# Altium schematic sheet ASCII_15_BoardPowerSupply.SchDoc: Board power supply
size A3; Organization: Lime Microsystems; Address1: Surrey Tech Centre; Address2: Guildford GU2 7YG; Address3: Surrey; Address4: United Kingdom; Revision: v1.4; SheetNumber: 15; SheetTotal: 15
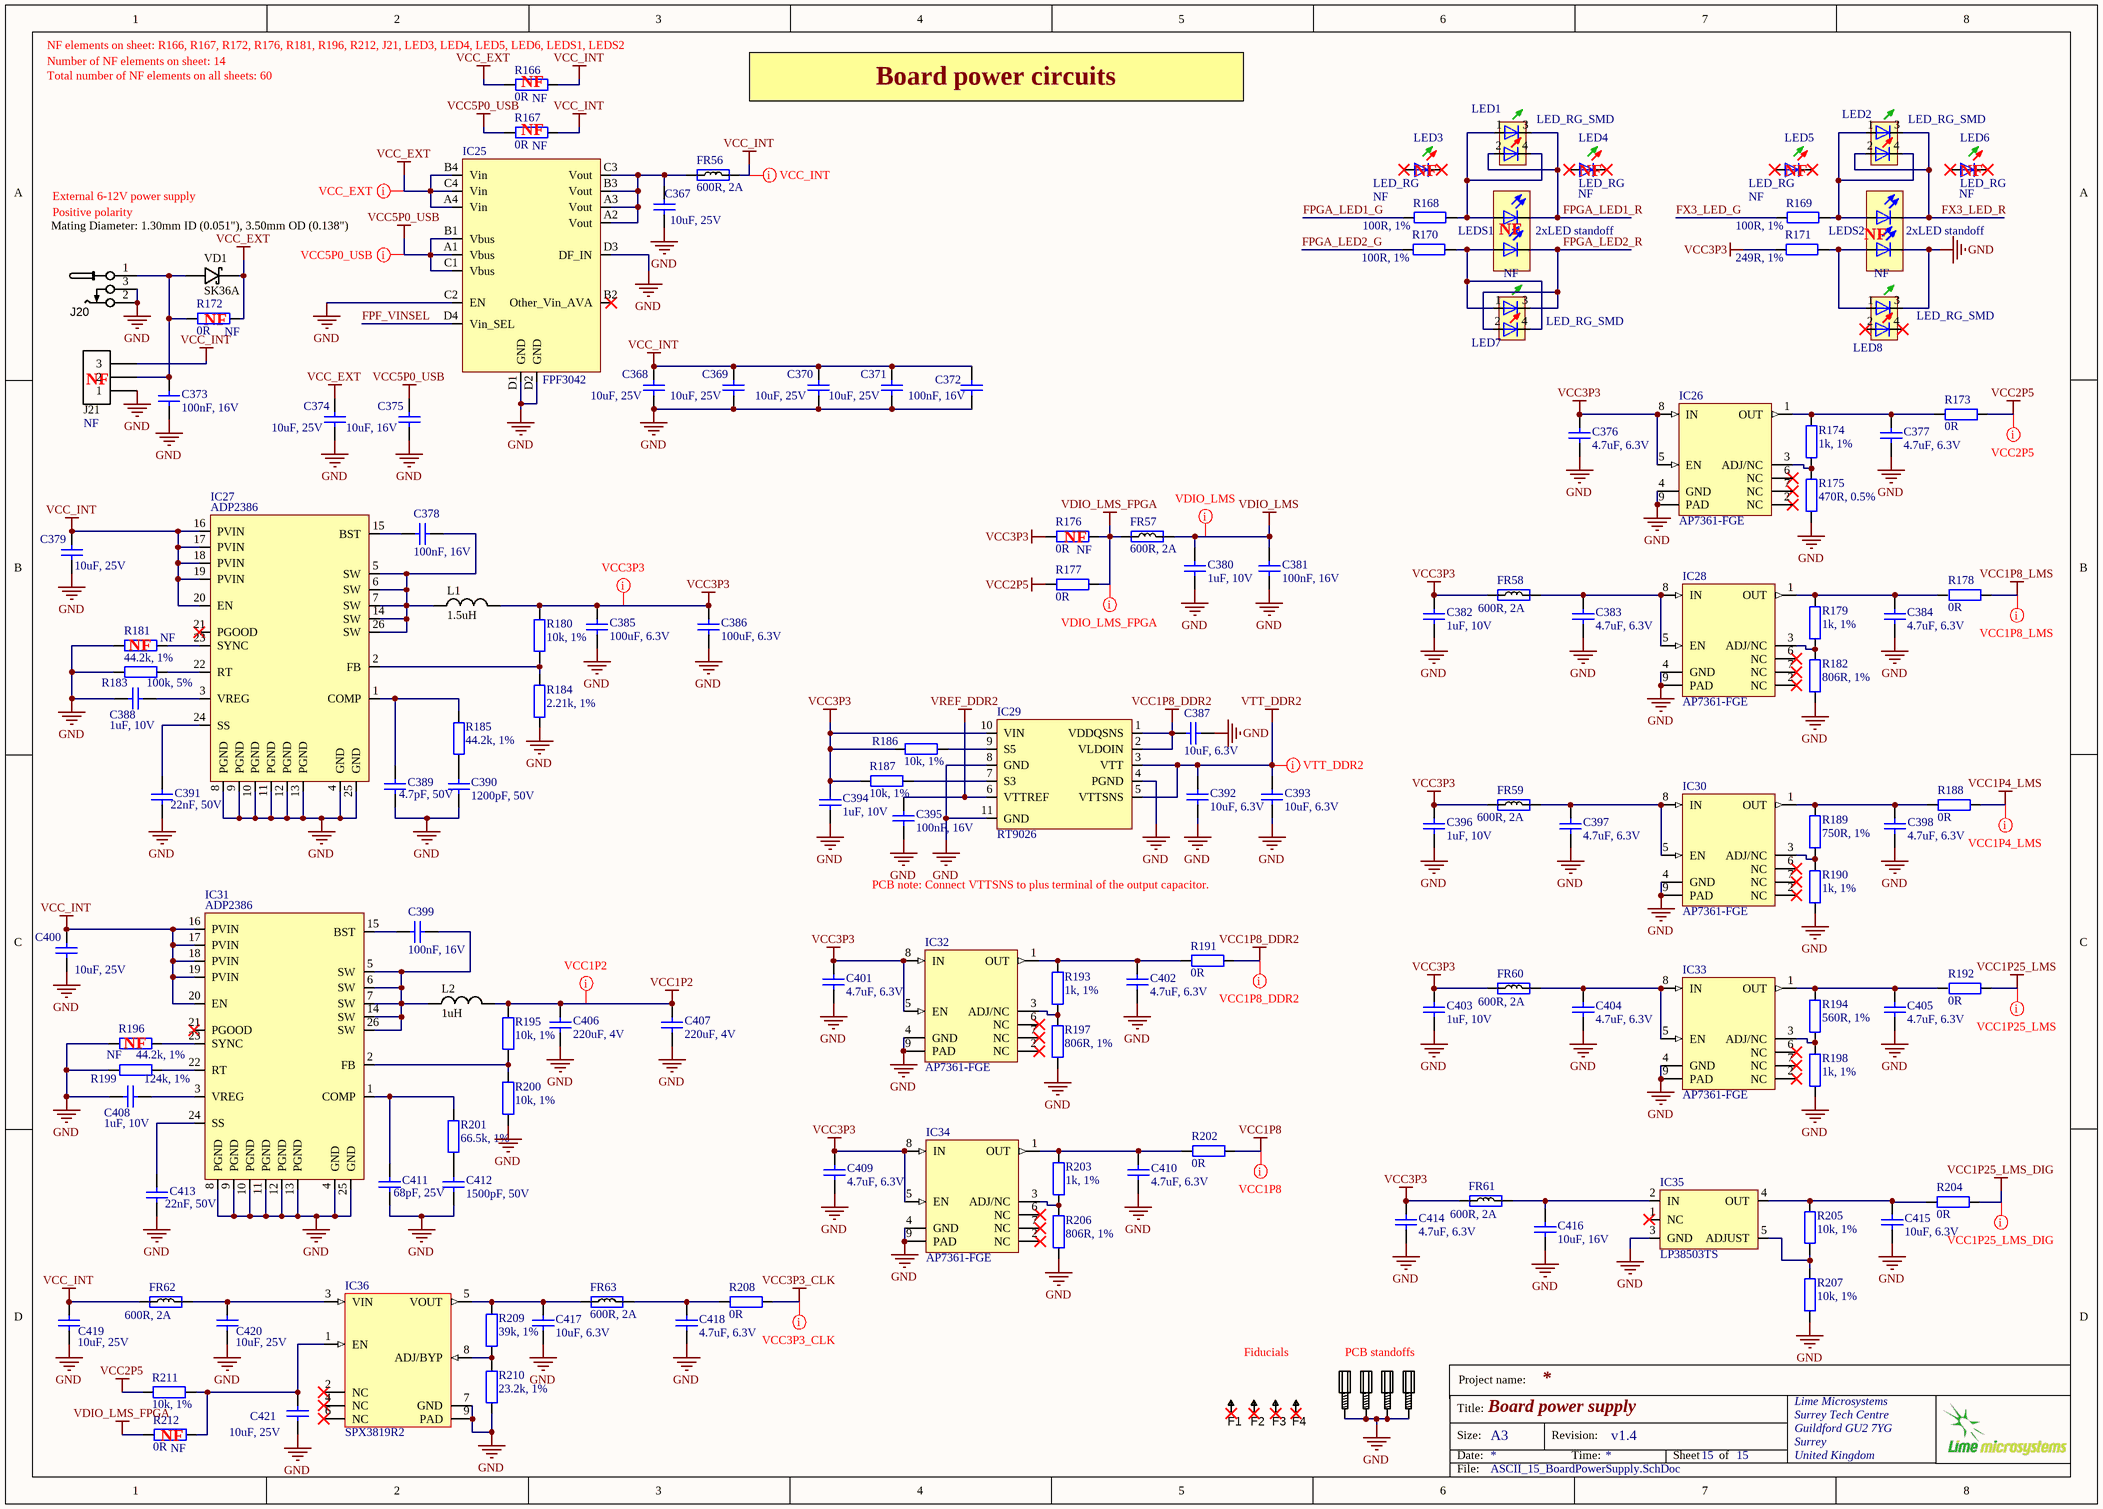
[diagram p0: ASCII_15_BoardPowerSupply.SchDoc]

## Parts
C367  10uF, 25V  [CAP0603]
C368  10uF, 25V  [CAP0603]
C369  10uF, 25V  [CAP0603]
C370  10uF, 25V  [CAP0603]
C371  10uF, 25V  [CAP0603]
C372  100nF, 16V  [CAP0402]
C373  100nF, 16V  [CAP0402]
C374  10uF, 25V  [CAP0603]
C375  10uF, 16V  [CAP0603]
C376  4.7uF, 6.3V  [CAP0402]
C377  4.7uF, 6.3V  [CAP0402]
C378  100nF, 16V  [CAP0402]
C379  10uF, 25V  [CAP0603]
C380  1uF, 10V  [CAP0402]
C381  100nF, 16V  [CAP0402]
C382  1uF, 10V  [CAP0402]
C383  4.7uF, 6.3V  [CAP0402]
C384  4.7uF, 6.3V  [CAP0402]
C385  100uF, 6.3V  [CAP1206]
C386  100uF, 6.3V  [CAP1206]
C387  10uF, 6.3V  [CAP0603]
C388  1uF, 10V  [CAP0402]
C389  4.7pF, 50V  [CAP0402]
C390  1200pF, 50V  [CAP0402]
C391  22nF, 50V  [CAP0402]
C392  10uF, 6.3V  [CAP0603]
C393  10uF, 6.3V  [CAP0603]
C394  1uF, 10V  [CAP0402]
C395  100nF, 16V  [CAP0402]
C396  1uF, 10V  [CAP0402]
C397  4.7uF, 6.3V  [CAP0402]
C398  4.7uF, 6.3V  [CAP0402]
C399  100nF, 16V  [CAP0402]
C400  10uF, 25V  [CAP0603]
C401  4.7uF, 6.3V  [CAP0402]
C402  4.7uF, 6.3V  [CAP0402]
C403  1uF, 10V  [CAP0402]
C404  4.7uF, 6.3V  [CAP0402]
C405  4.7uF, 6.3V  [CAP0402]
C406  220uF, 4V  [CAP1206]
C407  220uF, 4V  [CAP1206]
C408  1uF, 10V  [CAP0402]
C409  4.7uF, 6.3V  [CAP0402]
C410  4.7uF, 6.3V  [CAP0402]
C411  68pF, 25V  [CAP0402]
C412  1500pF, 50V  [CAP0402]
C413  22nF, 50V  [CAP0402]
C414  4.7uF, 6.3V  [CAP0402]
C415  10uF, 6.3V  [CAP0603]
C416  10uF, 16V  [CAP0603]
C417  10uF, 6.3V  [CAP0603]
C418  4.7uF, 6.3V  [CAP0402]
C419  10uF, 25V  [CAP0603]
C420  10uF, 25V  [CAP0603]
C421  10uF, 25V  [CAP0603]
F1  Fiducial  [Fiducial]  (value not drawn)
F2  Fiducial  [Fiducial]  (value not drawn)
F3  Fiducial  [Fiducial]  (value not drawn)
F4  Fiducial  [Fiducial]  (value not drawn)
FR56  600R, 2A  [RES0805]
FR57  600R, 2A  [RES0805]
FR58  600R, 2A  [RES0805]
FR59  600R, 2A  [RES0805]
FR60  600R, 2A  [RES0805]
FR61  600R, 2A  [RES0805]
FR62  600R, 2A  [RES0805]
FR63  600R, 2A  [RES0805]
IC25  FPF3042  [FPF3042]
IC26  AP7361-FGE  [AP7361]
IC27  ADP2386  [ADP2386]
IC28  AP7361-FGE  [AP7361]
IC29  RT9026  [MSOP10]
IC30  AP7361-FGE  [AP7361]
IC31  ADP2386  [ADP2386]
IC32  AP7361-FGE  [AP7361]
IC33  AP7361-FGE  [AP7361]
IC34  AP7361-FGE  [AP7361]
IC35  LP38503TS  [TO-263-5_v2]
IC36  SPX3819R2  [SPX3819R2-L/TR]
J20  Mating Diameter: 1.30mm ID (0.051"), 3.50mm OD (0.138")  [CONN_PWR_JACK_v4]
J21  Assembly Info: NF  [HDR_1x3]  (hidden comment: Header 3x1 pin)
L1  1.5uH  [FDVE1040_TOKO_INDUCTOR]
L2  1uH  [FDVE1040_TOKO_INDUCTOR]
LED1  LED_RG_SMD  [LED-2x0603]
LED2  LED_RG_SMD  [LED-2x0603]
LED3  LED_RG  Assembly Info: NF  (mechanical)
LED4  LED_RG  Assembly Info: NF  (mechanical)
LED5  LED_RG  Assembly Info: NF  (mechanical)
LED6  LED_RG  Assembly Info: NF  (mechanical)
LED7  LED_RG_SMD  [LED-2x0603]
LED8  LED_RG_SMD  [LED-2x0603]
LEDS1  2xLED standoff  Assembly Info: NF  [LED_STANDOFF_H-201C]
LEDS2  2xLED standoff  Assembly Info: NF  [LED_STANDOFF_H-201C]
MECH1  # pcs.  [PCB_standoff]  (value not drawn)
MECH2  # pcs.  [PCB_standoff]  (value not drawn)
MECH3  # pcs.  [PCB_standoff]  (value not drawn)
MECH4  # pcs.  [PCB_standoff]  (value not drawn)
R166  0R  Assembly Info: NF  [RES0402]
R167  0R  Assembly Info: NF  [RES0402]
R168  100R, 1%  [RES0402]
R169  100R, 1%  [RES0402]
R170  100R, 1%  [RES0402]
R171  249R, 1%  [RES0402]
R172  0R  Assembly Info: NF  [RES0805]
R173  0R  [RES0402]
R174  1k, 1%  [RES0402]
R175  470R, 0.5%  [RES0402]
R176  0R  Assembly Info: NF  [RES0402]
R177  0R  [RES0402]
R178  0R  [RES0402]
R179  1k, 1%  [RES0402]
R180  10k, 1%  [RES0402]
R181  44.2k, 1%  Assembly Info: NF  [RES0402]
R182  806R, 1%  [RES0402]
R183  100k, 5%  [RES0402]
R184  2.21k, 1%  [RES0402]
R185  44.2k, 1%  [RES0402]
R186  10k, 1%  [RES0402]
R187  10k, 1%  [RES0402]
R188  0R  [RES0402]
R189  750R, 1%  [RES0402]
R190  1k, 1%  [RES0402]
R191  0R  [RES0402]
R192  0R  [RES0402]
R193  1k, 1%  [RES0402]
R194  560R, 1%  [RES0402]
R195  10k, 1%  [RES0402]
R196  44.2k, 1%  Assembly Info: NF  [RES0402]
R197  806R, 1%  [RES0402]
R198  1k, 1%  [RES0402]
R199  124k, 1%  [RES0402]
R200  10k, 1%  [RES0402]
R201  66.5k, 1%  [RES0402]
R202  0R  [RES0402]
R203  1k, 1%  [RES0402]
R204  0R  [RES0402]
R205  10k, 1%  [RES0402]
R206  806R, 1%  [RES0402]
R207  10k, 1%  [RES0402]
R208  0R  [RES0402]
R209  39k, 1%  [RES0402]
R210  23.2k, 1%  [RES0402]
R211  10k, 1%  [RES0402]
R212  0R  Assembly Info: NF  [RES0402]
VD1  SK36A  [DIODE_SMB]

## Nets
GND: C367.1 C368.1 C369.1 C370.1 C371.1 C372.2 C373.2 C374.1 C375.1 C376.1 C377.1 C379.1 C380.1 C381.2 C382.1 C383.1 C384.1 C385.1 C386.1 C387.1 C388.2 C389.2 C390.2 C391.2 C392.1 C393.1 C394.1 C395.2 C396.1 C397.1 C398.1 C400.1 C401.1 C402.1 C403.1 C404.1 C405.1 C406.1 C407.1 C408.2 C409.1 C410.1 C411.2 C412.2 C413.2 C414.1 C415.1 C416.1 C417.1 C418.1 C419.1 C420.1 C421.1 IC25.C2(EN) IC25.D1(GND) IC25.D2(GND) IC25.D3(DF_IN) IC26.4(GND) IC26.9(PAD) IC27.4(GND) IC27.8(PGND) IC27.9(PGND) IC27.10(PGND) IC27.11(PGND) IC27.12(PGND) IC27.13(PGND) IC27.25(GND) IC28.4(GND) IC28.9(PAD) IC29.4(PGND) IC29.8(GND) IC29.11(GND) IC30.4(GND) IC30.9(PAD) IC31.4(GND) IC31.8(PGND) IC31.9(PGND) IC31.10(PGND) IC31.11(PGND) IC31.12(PGND) IC31.13(PGND) IC31.25(GND) IC32.4(GND) IC32.9(PAD) IC33.4(GND) IC33.9(PAD) IC34.4(GND) IC34.9(PAD) IC35.3(GND) IC36.7(GND) IC36.9(PAD) J20.2 J20.3 J21.1 LED8.3 LEDS2.K2(C) MECH1.MH1 MECH2.MH1 MECH3.MH1 MECH4.MH1 R175.2 R181.2 R182.2 R183.2 R184.1 R190.1 R196.2 R197.2 R198.1 R199.2 R200.2 R206.2 R207.2 R210.1
VCC1P2: C406.2 C407.2 L2.2 R195.1
VCC1P4_LMS: R188.1
VCC1P8: R202.1
VCC1P8_DDR2: C387.2 IC29.1(VDDQSNS) IC29.2(VLDOIN) R191.1
VCC1P8_LMS: R178.1
VCC1P25_LMS: R192.1
VCC1P25_LMS_DIG: R204.1
VCC2P5: R173.1 R177.2 R211.1
VCC3P3: C376.2 C382.2 C385.2 C386.2 C394.2 C396.2 C401.2 C403.2 C409.2 C414.2 FR58.1 FR59.1 FR60.1 FR61.1 IC26.5(EN) IC26.8(IN) IC29.10(VIN) IC32.5(EN) IC32.8(IN) IC34.5(EN) IC34.8(IN) L1.2 R171.1 R176.2 R180.1 R186.1 R187.1
VCC3P3_CLK: R208.1
VCC5P0_USB: C375.2 IC25.A1(Vbus) IC25.B1(Vbus) IC25.C1(Vbus) R167.2
VCC_EXT: C374.2 IC25.A4(Vin) IC25.B4(Vin) IC25.C4(Vin) R166.2 R172.1 VD1.K
VCC_INT: C368.2 C369.2 C370.2 C371.2 C372.1 C379.2 C400.2 C419.2 FR56.1 FR62.1 IC27.16(PVIN) IC27.17(PVIN) IC27.18(PVIN) IC27.19(PVIN) IC27.20(EN) IC31.16(PVIN) IC31.17(PVIN) IC31.18(PVIN) IC31.19(PVIN) IC31.20(EN) J21.3 R166.1 R167.1
VDIO_LMS: C380.2 C381.1 FR57.2
VDIO_LMS_FPGA: FR57.1 R176.1 R177.1 R212.2
VREF_DDR2: C395.1 IC29.6(VTTREF)
VTT_DDR2: C392.2 C393.2 IC29.3(VTT) IC29.5(VTTSNS)
FPF_VINSEL: IC25.D4(Vin_SEL)
FPGA_LED1_G: R168.1
FPGA_LED1_R: LED1.2 LED1.3 LEDS1.K1(C)
FPGA_LED2_G: R170.1
FPGA_LED2_R: LED7.2 LED7.3 LEDS1.K2(C)
FX3_LED_G: R169.1
FX3_LED_R: LED2.2 LED2.3 LEDS2.K1(C)
NetC367_2: C367.2 FR56.2 IC25.A2(Vout) IC25.A3(Vout) IC25.B3(Vout) IC25.C3(Vout)
NetC373_1: C373.1 J20.1 J21.2 R172.2 VD1.A
NetC377_2: C377.2 IC26.1(OUT) R173.2 R174.2
NetC378_1: C378.1 IC27.15(BST)
NetC378_2: C378.2 IC27.5(SW) IC27.6(SW) IC27.7(SW) IC27.14(SW) IC27.26(SW) L1.1
NetC383_2: C383.2 FR58.2 IC28.5(EN) IC28.8(IN)
NetC384_2: C384.2 IC28.1(OUT) R178.2 R179.2
NetC388_1: C388.1 IC27.3(VREG)
NetC389_1: C389.1 IC27.1(COMP) R185.2
NetC390_1: C390.1 R185.1
NetC391_1: C391.1 IC27.24(SS)
NetC397_2: C397.2 FR59.2 IC30.5(EN) IC30.8(IN)
NetC398_2: C398.2 IC30.1(OUT) R188.2 R189.1
NetC399_1: C399.1 IC31.15(BST)
NetC399_2: C399.2 IC31.5(SW) IC31.6(SW) IC31.7(SW) IC31.14(SW) IC31.26(SW) L2.1
NetC402_2: C402.2 IC32.1(OUT) R191.2 R193.2
NetC404_2: C404.2 FR60.2 IC33.5(EN) IC33.8(IN)
NetC405_2: C405.2 IC33.1(OUT) R192.2 R194.2
NetC408_1: C408.1 IC31.3(VREG)
NetC410_2: C410.2 IC34.1(OUT) R202.2 R203.2
NetC411_1: C411.1 IC31.1(COMP) R201.2
NetC412_1: C412.1 R201.1
NetC413_1: C413.1 IC31.24(SS)
NetC415_2: C415.2 IC35.4(OUT) R204.2 R205.1
NetC416_2: C416.2 FR61.2 IC35.2(IN)
NetC417_2: C417.2 FR63.1 IC36.5(VOUT) R209.1
NetC418_2: C418.2 FR63.2 R208.2
NetC420_2: C420.2 FR62.2 IC36.3(VIN)
NetC421_2: C421.2 IC36.1(EN) R211.2 R212.1
NetIC26_3: IC26.3(ADJ/NC) R174.1 R175.1
NetIC27_2: IC27.2(FB) R180.2 R184.2
NetIC27_22: IC27.22(RT) R183.1
NetIC27_23: IC27.23(SYNC) R181.1
NetIC28_3: IC28.3(ADJ/NC) R179.1 R182.1
NetIC29_7: IC29.7(S3) R187.2
NetIC29_9: IC29.9(S5) R186.2
NetIC30_3: IC30.3(ADJ/NC) R189.2 R190.2
NetIC31_2: IC31.2(FB) R195.2 R200.1
NetIC31_22: IC31.22(RT) R199.1
NetIC31_23: IC31.23(SYNC) R196.1
NetIC32_3: IC32.3(ADJ/NC) R193.1 R197.1
NetIC33_3: IC33.3(ADJ/NC) R194.1 R198.2
NetIC34_3: IC34.3(ADJ/NC) R203.1 R206.1
NetIC35_5: IC35.5(ADJUST) R205.2 R207.1
NetIC36_8: IC36.8(ADJ/BYP) R209.2 R210.2
NetLED1_1: LED1.1 LED1.4 LEDS1.A1(A) R168.2
NetLED2_1: LED2.1 LED2.4 LEDS2.A1(A) R169.2
NetLED7_1: LED7.1 LED7.4 LEDS1.A2(A) R170.2
NetLED8_1: LED8.1 LEDS2.A2(A) R171.2

Not connected (* = marked no-connect by the designer): F1 1*; F2 1*; F3 1*; F4 1*; IC25 B2(Other_Vin_AVA)*; IC26 2(NC)* 6(NC)* 7(NC)*; IC27 21(PGOOD)*; IC28 2(NC)* 6(NC)* 7(NC)*; IC30 2(NC)* 6(NC)* 7(NC)*; IC31 21(PGOOD)*; IC32 2(NC)* 6(NC)* 7(NC)*; IC33 2(NC)* 6(NC)* 7(NC)*; IC34 2(NC)* 6(NC)* 7(NC)*; IC35 1(NC)*; IC36 2(NC)* 4(NC)* 6(NC)*; LED3 A* K(C)*; LED4 A* K(C)*; LED5 A* K(C)*; LED6 A* K(C)*; LED8 2* 4*

## Layout directives
net class VDIO_LMS: VDIO_LMS
net class VDIO_LMS_FPGA: VDIO_LMS_FPGA
net class VCC2P5: VCC2P5
net class VCC1P8_LMS: VCC1P8_LMS
net class VCC1P4_LMS: VCC1P4_LMS
net class VCC1P25_LMS: VCC1P25_LMS
net class VCC1P25_LMS_DIG: VCC1P25_LMS_DIG
net class VCC1P8_DDR2: VCC1P8_DDR2
net class VCC1P8: VCC1P8
net class VCC3P3_CLK: VCC3P3_CLK
net class VCC1P2: VCC1P2
net class VCC3P3: VCC3P3
net class VCC_INT: VCC_INT
net class VCC_EXT: VCC_EXT
net class VCC5P0_USB: VCC5P0_USB
net class VTT_DDR2: VTT_DDR2

## Notes on the sheet
- Number of NF elements on sheet: 14
- Total number of NF elements on all sheets: 60
- (near R166) NF elements on sheet: R166, R167, R172, R176, R181, R196, R212, J21, LED3, LED4, LED5, LED6, LEDS1, LEDS2
- (near R166) NF
- Board power circuits
- (near R167) NF
- (near LED3) NF
- (near LED4) NF
- (near LED5) NF
- (near LED6) NF
- Positive polarity
- External 6-12V power supply
- (near LEDS1) NF
- (near LEDS2) NF
- (near J21) NF
- (near R172) NF
- (near R176) NF
- (near R181) NF
- PCB note: Connect VTTSNS to plus terminal of the output capacitor.
- (near R196) NF
- Fiducials
- PCB standoffs
- (near R212) NF
- Project name:
- Title:
- Size:
- Date:
- A3
- Revision:
- Time:
- Sheet
- of
- File:

## Library data of the parts
C367-C371 C374 C379 C400 C419-C421 = Cap_0603: Manufacturer: Murata Electronics North America; Manufacturer Part Number: GRM188R61E106MA73D; Part Description: 10µF ±20% 25V X5R Ceramic Capacitor -55°C ~ 85°C Surface Mount, MLCC 0603 (1608 Metric) 0.063" L x 0.031" W (1.60mm x 0.80mm); Capacitance: 10µF; Tolerance: ±20%; Temperature Coefficient: X5R; Supplier 1: Digi-Key; Supplier Part Number 1: 490-7202-2-ND; Category: Capacitors; RoHS: RoHS Compliant; Packaging: Tape & Reel (TR); Voltage - Rated: 25V; Mounting Type: Surface Mount, MLCC; Operating Temperature: -55°C ~ 85°C; Applications: General Purpose; Ratings: -; Package / Case: 0603 (1608 Metric); Size / Dimension: 0.063" L x 0.031" W (1.60mm x 0.80mm); Height - Seated (Max): -; Thickness (Max): 0.031" (0.80mm); Lead Spacing: -; Features: -; Lead Style: -; value: 10uF, 25V
C372 C373 C381 C395 = Cap_0402: Manufacturer: Murata Electronics; Manufacturer Part Number: GRM155R71C104KA88D; Part Description: 0.10µF ±10% 16V X7R Ceramic Capacitor -55°C ~ 125°C Surface Mount, MLCC 0402 (1005 Metric) 0.039" L x 0.020" W (1.00mm x 0.50mm); Tolerance: 10 %; Type: General Purpose MLCC; Capacitance: 0.1 uF; Case Length: 1 mm; Dielectric: X7R; Case Height: 0.5 mm; Temperature Coefficient / Code: +/- 15 %; Value: 100nF, 16V; Supplier 1: Mouser; Supplier Part Number 1: 81-GRM155R71C104KA88; Case Code - in: 0402; RoHS: RoHS Compliant; Operating Temperature Range: - 55 C to + 125 C; Series: GRM; Termination Style: SMD/SMT; Package / Case: 0402 (1005 metric); Voltage Rating DC: 16 V; Maximum Operating Temperature: + 125 C; Case Code - mm: 1005; Minimum Operating Temperature: - 55 C; Product Category: Low & Medium Capacitance SMD Ceramic Chip Capacitors; Packaging: Reel; Product: General Type MLCCs; Category: Multilayer Ceramic Capacitors MLCC - SMD/SMT; Brand: Murata Electronics; Case Width: 0.5 mm; RoHS - Mouser: Y; Standard Pack Qty: 10000; Minimum Order Quantity: 1; Reeling: True; Manufacturer Part Number 1: GRM155R71C104KA88D
C375 C416 = Cap_0603: Manufacturer: Yageo; Manufacturer Part Number 1: GRM188R61C106MA73D; Part Description: 10µF ±20% 16V X5R Ceramic Capacitor -55°C ~ 85°C Surface Mount, MLCC 0603 (1608 Metric) 0.063" L x 0.031" W (1.60mm x 0.80mm); Temperature Coefficient: X5R; Capacitance: 10µF; Tolerance: ±20%; Value: 10uF, 16V; Supplier 1: Digi-Key; Supplier Part Number 1: 490-7201-2-ND; Category: Capacitors; Ratings: -; Features: -; Lead Style: -; Package / Case: 0603 (1608 Metric); Lead Spacing: -; Applications: General Purpose; Voltage - Rated: 16V; Operating Temperature: -55°C ~ 85°C; Thickness (Max): 0.039" (1.00mm); Mounting Type: Surface Mount, MLCC; RoHS: RoHS Compliant; Size / Dimension: 0.063" L x 0.031" W (1.60mm x 0.80mm); Packaging: Tape & Reel (TR); Height - Seated (Max): -
C376 C377 C383 C384 C397 C398 C401 C402 C404 C405 C409 C410 C414 C418 = Cap_0402: Manufacturer: Murata Electronics North America; Manufacturer Part Number: GRM155R60J475ME87D; Part Description: 4.7µF ±20% 6.3V X5R Ceramic Capacitor -55°C ~ 85°C Surface Mount, MLCC 0402 (1005 Metric) 0.039" L x 0.020" W (1.00mm x 0.50mm); Tolerance: ±20%; Capacitance: 4.7µF; Temperature Coefficient: X5R; Lead Style: -; Ratings: -; Height - Seated (Max): -; Thickness (Max): 0.022" (0.55mm); Voltage - Rated: 6.3V; Packaging: Cut Tape (CT); Lead Spacing: -; Category: Capacitors; Supplier Part Number 1: 490-5408-1-ND; Applications: General Purpose; Operating Temperature: -55°C ~ 85°C; Mounting Type: Surface Mount, MLCC; Features: Derating Recommended; RoHS: RoHS Compliant; Supplier 1: Digi-Key; Package / Case: 0402 (1005 Metric); Size / Dimension: 0.039" L x 0.020" W (1.00mm x 0.50mm); Value: 4.7uF, 6.3V
C378 C399 = Cap_0402: Manufacturer: Murata Electronics; Manufacturer Part Number 1: GRM155R71C104KA88D; Part Description: 0.10µF ±10% 16V X7R Ceramic Capacitor -55°C ~ 125°C Surface Mount, MLCC 0402 (1005 Metric) 0.039" L x 0.020" W (1.00mm x 0.50mm); Tolerance: 10 %; Type: General Purpose MLCC; Capacitance: 0.1 uF; Case Length: 1 mm; Dielectric: X7R; Case Height: 0.5 mm; Temperature Coefficient / Code: +/- 15 %; Value: 100nF, 16V; Supplier 1: Mouser; Supplier Part Number 1: 81-GRM155R71C104KA88; Case Code - in: 0402; RoHS: RoHS Compliant; Operating Temperature Range: - 55 C to + 125 C; Series: GRM; Termination Style: SMD/SMT; Package / Case: 0402 (1005 metric); Voltage Rating DC: 16 V; Maximum Operating Temperature: + 125 C; Case Code - mm: 1005; Minimum Operating Temperature: - 55 C; Product Category: Low & Medium Capacitance SMD Ceramic Chip Capacitors; Packaging: Reel; Product: General Type MLCCs; Category: Multilayer Ceramic Capacitors MLCC - SMD/SMT; Brand: Murata Electronics; Case Width: 0.5 mm; RoHS - Mouser: Y; Standard Pack Qty: 10000; Minimum Order Quantity: 1; Reeling: True; Manufacturer Part Number: GRM155R71C104KA88D
C380 C382 C388 C394 C396 C403 C408 = Cap_0402: Manufacturer Part Number 1: GRM155R61A105KE15J; Manufacturer: TDK; Part Description: 1µF ±10% 10V X5R Ceramic Capacitor -55°C ~ 85°C Surface Mount, MLCC 0402 (1005 Metric) 0.039" L x 0.020" W (1.00mm x 0.50mm); Voltage Rating: 10; Capacitance Tolerance: ± 10%; Product Range: TDK - C Series; Ceramic Capacitor Case: 0402 [1005 Metric]; Capacitance: 1; Dielectric Characteristic: X6; Value: 1uF, 10V; Supplier 1: Newark; Supplier Part Number 1: 490-6298-2-ND; MSL: -; RoHS: YES
C385 C386 = Cap_1206: Manufacturer Part Number 1: GRM31CR60J107ME39L.; Part Description: 100µF ±20% 6.3V X5R Ceramic Capacitor -55°C ~ 85°C Surface Mount, MLCC 1206 (3216 Metric) 0.126" L x 0.063" W (3.20mm x 1.60mm); Manufacturer: Murata Electronics North America; Capacitance Tolerance: ± 20%; Ceramic Capacitor Case: 1206 [3216 Metric]; Voltage Rating: 6.3; value: 100uF, 6.3V; Supplier Part Number 1: 1735535; Supplier 1: Farnell
C387 C392 C393 C415 C417 = Cap_0603: Manufacturer Part Number 1: CC0603MRX5R5BB106; Part Description: 10µF ±20% 6.3V X5R Ceramic Capacitor -55°C ~ 85°C Surface Mount, MLCC 0603 (1608 Metric) 0.063" L x 0.031" W (1.60mm x 0.80mm); Manufacturer: Yageo; Capacitance: 10µF; Tolerance: ±20%; Supplier 1: Digi-Key; Supplier Part Number 1: 311-1448-2-ND; Package / Case: 0603 (1608 Metric); Category: Capacitors; Voltage - Rated: 6.3V; Value: 10uF, 6.3V
C389 = Cap_0402: Manufacturer Part Number 1: GRM1555C1H4R7CA01D; Part Description: 4.7pF ±0.25pF 50V C0G, NP0 Ceramic Capacitor -55°C ~ 125°C Surface Mount, MLCC 0402 (1005 Metric) 0.039" L x 0.020" W (1.00mm x 0.50mm); Manufacturer: Murata Electronics North America; Capacitance Tolerance: ± 0.25; Voltage Rating: 50; Dielectric Characteristic: C0G / NP0; Ceramic Capacitor Case: 0402 [1005 Metric]; Capacitance: 4.7; SVHC: No SVHC (15-Jun-2015; Product Range: GRM Series; Value: 4.7pF, 50V; Supplier 1: Farnell; Supplier Part Number 1: 2434644; Operating Temperature Max: 125; Operating Temperature Min: -55; MSL: MSL 1 - Unlimited; RoHS: YES; Packaging: Cut Tape
C390 = Cap_0402: Manufacturer: Kemet; Manufacturer Part Number 1: C0402C122J5GACTU; Part Description: 1200pF ±5% 50V C0G, NP0 Ceramic Capacitor -55°C ~ 125°C Surface Mount, MLCC 0402 (1005 Metric) 0.039" L x 0.020" W (1.00mm x 0.50mm); Temperature Coefficient: C0G, NP0; Tolerance: ±5%; Value: 1200pF, 50V; Supplier 1: Digi-Key; Supplier Part Number 1: 399-7334-1-ND; Thickness (Max): 0.022" (0.55mm); Capacitance: 1200pF; Lead Spacing: -; Mounting Type: Surface Mount, MLCC; Package / Case: 0402 (1005 Metric); Category: Capacitors; Size / Dimension: 0.039" L x 0.020" W (1.00mm x 0.50mm); Voltage - Rated: 50V; Lead Style: -; Ratings: -; Features: -; Packaging: Cut Tape (CT); RoHS: RoHS Compliant; Operating Temperature: -55°C ~ 125°C; Applications: General Purpose; Height - Seated (Max): -
C391 C413 = Cap_0402: Manufacturer: Kemet; Manufacturer Part Number 1: C0402C223K5RACTU; Part Description: 0.022µF ±10% 50V X7R Ceramic Capacitor -55°C ~ 125°C Surface Mount, MLCC 0402 (1005 Metric) 0.039" L x 0.020" W (1.00mm x 0.50mm); Temperature Coefficient: X7R; Tolerance: ±10%; Capacitance: 0.022µF; Value: 22nF, 50V; Supplier 1: Digi-Key; Supplier Part Number 1: 399-7780-1-ND; Ratings: -; Packaging: Cut Tape (CT); Category: Capacitors; Size / Dimension: 0.039" L x 0.020" W (1.00mm x 0.50mm); RoHS: RoHS Compliant; Operating Temperature: -55°C ~ 125°C; Mounting Type: Surface Mount, MLCC; Applications: General Purpose; Voltage - Rated: 50V; Thickness (Max): 0.022" (0.55mm); Features: -; Height - Seated (Max): -; Lead Style: -; Package / Case: 0402 (1005 Metric); Lead Spacing: -
C406 C407 = Cap_1206: Manufacturer: Murata Electronics North America; Manufacturer Part Number 1: GRM31CR60G227ME11L; Part Description: 220µF ±20% 4V X5R Ceramic Capacitor -55°C ~ 85°C Surface Mount, MLCC 1206 (3216 Metric) 0.126" L x 0.063" W (3.20mm x 1.60mm); Capacitance: 220µF; Tolerance: ±20%; Temperature Coefficient: X5R; value: 220uF, 4V; Supplier 1: Digi-Key; Supplier Part Number 1: 490-9774-1-ND; Category: Capacitors; Height - Seated (Max): -; Voltage - Rated: 4V; Lead Style: -; Packaging: Digi-Reel®; Package / Case: 1206 (3216 Metric); Mounting Type: Surface Mount, MLCC; Applications: General Purpose; Lead Spacing: -; Ratings: -; RoHS: RoHS Compliant; Operating Temperature: -55°C ~ 85°C; Size / Dimension: 0.126" L x 0.063" W (3.20mm x 1.60mm); Thickness (Max): 0.075" (1.90mm); Features: -; Manufacturer Part Number: GRM31CR60G227ME11L
C411 = Cap_0402: Manufacturer Part Number 1: CBR04C680F3GAC; Manufacturer: Kemet; Part Description: 68pF ±1% 25V C0G, NP0 Ceramic Capacitor -55°C ~ 125°C Surface Mount, MLCC 0402 (1005 Metric) 0.039" L x 0.020" W (1.00mm x 0.50mm); Temperature Coefficient: C0G, NP0; Tolerance: ±1%; Value: 68pF, 25V; Supplier 1: Digi-Key; Supplier Part Number 1: 399-11255-1-ND; Applications: RF, Microwave, High Frequency; Voltage - Rated: 25V; Capacitance: 68pF; Mounting Type: Surface Mount, MLCC; Package / Case: 0402 (1005 Metric); Features: High Q, Low Loss; Lead Spacing: -; Size / Dimension: 0.039" L x 0.020" W (1.00mm x 0.50mm); Operating Temperature: -55°C ~ 125°C; Packaging: Cut Tape (CT); Thickness (Max): 0.022" (0.55mm); Category: Capacitors; Lead Style: -; Ratings: -; Height - Seated (Max): -; RoHS: RoHS Compliant
C412 = Cap_0402: Manufacturer Part Number 1: CL05B152KB5NNNC; Manufacturer: Samsung Electro-Mechanics America, Inc.; Part Description: 1500pF ±10% 50V X7R Ceramic Capacitor -55°C ~ 125°C Surface Mount, MLCC 0402 (1005 Metric) 0.039" L x 0.020" W (1.00mm x 0.50mm); Temperature Coefficient: X7R; Tolerance: ±10%; Value: 1500pF, 50V; Supplier 1: Digi-Key; Supplier Part Number 1: 1276-1521-1-ND; Thickness (Max): 0.022" (0.55mm); Features: -; Category: Capacitors; Size / Dimension: 0.039" L x 0.020" W (1.00mm x 0.50mm); RoHS: RoHS Compliant; Package / Case: 0402 (1005 Metric); Mounting Type: Surface Mount, MLCC; Packaging: Cut Tape (CT); Lead Style: -; Lead Spacing: -; Capacitance: 1500pF; Voltage - Rated: 50V; Applications: General Purpose; Height - Seated (Max): -; Ratings: -; Operating Temperature: -55°C ~ 125°C
FR56 = Ferrite: Manufacturer Part Number 1: MPZ2012S601AT000; Manufacturer: TDK Corporation; Part Description: FERRITE BEAD 600 OHM 0805 1LN; DC Resistance (DCR): 100 mOhm Max; Filter Type: Differential Mode - Single; Impedance @ Frequency: 600 Ohm @ 100MHz; Supplier 1: Digi-Key; Supplier Part Number 1: 445-2206-2-ND; Value: 600R, 2A; Category: Filters; Current Rating: 2A; Height (Max): 0.041" (1.05mm); Mounting Type: Surface Mount; Package / Case: 0805 (2012 Metric); Packaging: Tape & Reel (TR); RoHS: RoHS Compliant; Size / Dimension: 0.079" L x 0.049" W (2.00mm x 1.25mm)
FR57-FR63 = Ferrite: Manufacturer Part Number 1: MPZ2012S601AT000; Manufacturer: TDK Corporation; Part Description: FERRITE BEAD 600 OHM 0805 1LN; Filter Type: Differential Mode - Single; Impedance @ Frequency: 600 Ohm @ 100MHz; DC Resistance (DCR): 100 mOhm Max; Supplier 1: Digi-Key; Supplier Part Number 1: 445-2206-2-ND; Mounting Type: Surface Mount; RoHS: RoHS Compliant; Height (Max): 0.041" (1.05mm); Packaging: Tape & Reel (TR); Category: Filters; Current Rating: 2A; Package / Case: 0805 (2012 Metric); Size / Dimension: 0.079" L x 0.049" W (2.00mm x 1.25mm); Value: 600R, 2A
IC25 = FPF3042: Manufacturer: Fairchild Semiconductor; Manufacturer Part Number 1: FPF3042UCX; Part Description: IC OR CTRLR SRC SELECT 16WLCSP; Current - Output (Max): 2.7A; Voltage - Supply: 4 V ~ 12.4 V; FET Type: N-Channel; Internal Switch(s): Yes; Current - Supply: 55µA; Ratio - Input:Output: 2:1; Supplier 1: Digi-Key; Operating Temperature: -40°C ~ 85°C; Type: Source Selector Switch; Delay Time - OFF: -; Package / Case: 16-UFBGA, WLCSP; Delay Time - ON: -; Mounting Type: Surface Mount; Applications: Handheld/Mobile Devices; Supplier Device Package: 16-WLCSP; Packaging: Cut Tape (CT); Category: Integrated Circuits (ICs); RoHS: RoHS Compliant; Supplier Part Number 1: FPF3042UCXCT-ND
IC26 IC28 IC30 IC32-IC34 = AP7361: Manufacturer Part Number: AP7361-FGE-7; Manufacturer: Diodes Incorporated; Part Description: IC REG LDO ADJ 1A 8DFN; Regulator Topology: Positive Adjustable; Current - Output: 1A; Current - Limit (Min): 1.1A; Voltage - Dropout (Typical): 0.5V @ 1A; Voltage - Output: 0.8 V ~ 5.5 V; Number of Regulators: 1; Voltage - Input: 2.2 V ~ 6 V; Supplier 1: Digi-Key; Supplier Part Number 1: AP7361-FGE-7DICT-ND; RoHS: RoHS Compliant; Supplier Device Package: U-DFN3030-8; Mounting Type: Surface Mount; Category: Integrated Circuits (ICs); Packaging: Cut Tape (CT); Package / Case: 8-UDFN Exposed Pad; Operating Temperature: -40°C ~ 85°C
IC27 = ADP2386: Manufacturer Part Number: ADP2386ACPZN-R7; Manufacturer: Analog Devices Inc.; Part Description: IC REG BUCK ADJ 6A SYNC 24LFCSP; Function: Step-Down; Voltage - Output (Max): 18V; Synchronous Rectifier: Yes; Output Configuration: Positive; Frequency - Switching: 200kHz ~ 1.4MHz; Number of Outputs: 1; Output Type: Adjustable; Topology: Buck; Voltage - Input (Min): 4.5V; Voltage - Output (Min/Fixed): 0.6V; Voltage - Input (Max): 20V; Current - Output: 6A; Supplier 1: Digi-Key; Packaging: Digi-Reel®; RoHS: RoHS Compliant; Package / Case: 24-WFQFN Exposed Pad, CSP; Operating Temperature: -40°C ~ 125°C (TJ); Supplier Device Package 1: 24-LFCSP-WQ (4x4); Mounting Type: Surface Mount; Category: Integrated Circuits (ICs); Supplier Part Number 1: ADP2386ACPZN-R7DKR-ND
IC29 = RT9026: Manufacturer Part Number 1: RT9026GFP; Manufacturer: Richtek USA Inc.; Part Description: IC DDR TERMINATION REG 10MSOP; Number of Outputs: 1; Voltage - Input: 3.15 V ~ 5.5 V; Supplier 1: Digi-Key; Supplier Part Number 1: 1028-1010-1-ND; Supplier Device Package: 10-MSOP-EP; Operating Temperature: -40°C ~ 85°C; Applications: Converter, DDR Bus Termination Regulator; RoHS: RoHS Compliant; Packaging: Cut Tape (CT); Mounting Type: Surface Mount; Package / Case: 10-TFSOP, 10-MSOP (0.118", 3.00mm Width) Exposed Pad; Category: Integrated Circuits (ICs)
IC31 = ADP2386: Manufacturer Part Number 1: ADP2386ACPZN-R7; Manufacturer: Analog Devices Inc.; Part Description: IC REG BUCK ADJ 6A SYNC 24LFCSP; Function: Step-Down; Voltage - Output (Max): 18V; Synchronous Rectifier: Yes; Output Configuration: Positive; Frequency - Switching: 200kHz ~ 1.4MHz; Number of Outputs: 1; Output Type: Adjustable; Topology: Buck; Voltage - Input (Min): 4.5V; Voltage - Output (Min/Fixed): 0.6V; Voltage - Input (Max): 20V; Current - Output: 6A; Supplier 1: Digi-Key; Packaging: Digi-Reel®; RoHS: RoHS Compliant; Package / Case: 24-WFQFN Exposed Pad, CSP; Operating Temperature: -40°C ~ 125°C (TJ); Supplier Device Package: 24-LFCSP-WQ (4x4); Mounting Type: Surface Mount; Category: Integrated Circuits (ICs); Supplier Part Number 1: ADP2386ACPZN-R7DKR-ND
IC35 = LP38503TS: Manufacturer Part Number: LP38503TS-ADJ/NOPB; Manufacturer: Texas Instruments; Part Description: IC REG LDO ADJ 3A TO263-5; Regulator Topology: Positive Adjustable; Voltage - Dropout (Typical): 0.42V @ 3A; Number of Regulators: 1; Current - Output: 3A; Voltage - Output: 0.6 V ~ 5 V; Voltage - Input: 2.7 V ~ 5.5 V; Supplier 1: Digi-Key; Category: Integrated Circuits (ICs); RoHS: RoHS Compliant By Exemption; Operating Temperature: -40°C ~ 125°C; Packaging: Tube; Current - Limit (Min): -; Package / Case: TO-263-6, D²Pak (5 Leads + Tab), TO-263BA; Mounting Type: Surface Mount; Supplier Device Package: DDPAK/TO-263-5; Supplier Part Number 1: LP38503TS-ADJ/NOPB-ND
IC36 = SPX3819R2-L/TR: Manufacturer: Exar Corporation; Part Description: Linear Voltage Regulator IC Positive Adjustable 1 Output Adjustable 500mA 8-DFN (2x3); Regulator Topology: Positive Adjustable; Voltage - Output: Adjustable; Current - Output: 500mA; Voltage - Dropout (Typical): 0.34V @ 500mA; Number of Regulators: 1; Voltage - Input: 2.5 V ~ 16 V; Supplier 1: Digi-Key; Manufacturer Part Number 1: SPX3819R2-L/TR; RoHS: RoHS Compliant; Category: Integrated Circuits (ICs); Stock 1: 18339; Pricing 1: 1=0.98, 10=0.855, 25=0.7556, 100=0.6586, 250=0.57328, 500=0.48802, 1000=0.39089 (USD); Packaging: Cut Tape (CT); Part Status: Active; Current - Limit (Min): -; Operating Temperature: -40°C ~ 125°C; Mounting Type: Surface Mount; Package / Case: 8-VFDFN Exposed Pad; Supplier Device Package: 8-DFN (2x3); ComponentLink1URL: https://www.exar.com/content/document.ashx?id=615; ComponentLink1Description: https://www.exar.com/content/document.ashx?id=615; Supplier Part Number 1: 1016-1588-1-ND
J20 = CONN_PWR_JACK_2.1x5.5mm: Manufacturer Part Number 1: PJ-031DH; Manufacturer: CUI Inc.; Part Description: Power Barrel Connector Jack 1.30mm ID (0.051"), 3.50mm OD (0.138") Through Hole, Right Angle; Internal Switch(s): Single Switch, Normally Closed; Current Rating: 3.5A; Connector Type: Jack; Gender: Male; Shielding: Unshielded; Voltage - Rated: 16VDC; Plug/Mating Plug Diameter: 1.35mm ID, 3.5mm OD; Number of Positions/Contacts: 2 Conductors, 3 Contacts; Supplier 1: Digi-Key; Supplier Part Number 1: CP-031DH-ND; Operating Temperature: -25°C ~ 85°C; Contact Material: Brass; RoHS: RoHS Compliant; Color: Black; Features: -; Housing Material: Thermoplastic; Housing Color: Black; Contact Material - Plating: Nickel; Mounting Type: Through Hole, Right Angle; Termination: Solder; Category: Connectors, Interconnects
J21 = Header3P: Header, 3-pin; Manufacturer Part Number 1: 68000-103HLF; Manufacturer: Amphenol FCI; Part Description: 3 Positions Header, Unshrouded Connector 0.100" (2.54mm) Through Hole Gold or Gold, GXT; Connector Type: Header, Unshrouded; Pitch: 0.100" (2.54mm); Number of Positions Loaded: All; Number of Positions: 3; Supplier 1: Digi-Key; Supplier Part Number 1: 609-3461-ND; Features: -; Fastening Type: -; Contact Finish: Gold or Gold, GXT™; Contact Mating Length: 0.230" (5.84mm); Contact Type: Male Pin; RoHS: RoHS Compliant; Color: Black; Termination: Solder; Row Spacing: -; Category: Connectors, Interconnects; Mounting Type: Through Hole; Contact Finish Thickness: 30µin (0.76µm); Number of Rows: 1; Packaging: Bulk
L1 = Inductor_0603: Manufacturer: Vishay Dale; Manufacturer Part Number 1: IHLP4040DZER1R5M01; Part Description: FIXED IND 1.5UH 15A 5.8 MOHM SMD; DC Resistance (DCR): 5.8 mOhm Max; Inductance: 1.5µH; Shielding: Shielded; Type: Molded; Current Rating: 15A; Frequency - Test: 100kHz; Current - Saturation: 27.5A; Tolerance: ±20%; Value: 1.5uH; Supplier 1: Digi-Key; Supplier Part Number 1: 541-1301-6-ND; Package / Case: Nonstandard; Q @ Freq: -; Packaging: Digi-Reel®; Material - Core: -; Category: Inductors, Coils, Chokes; Frequency - Self Resonant: -; Height - Seated (Max): 0.158" (4.00mm); Supplier Device Package: -; RoHS: RoHS Compliant; Size / Dimension: 0.430" L x 0.405" W (10.92mm x 10.30mm); Mounting Type: Surface Mount; Operating Temperature: -55°C ~ 125°C
L2 = Inductor_0603: Manufacturer: Vishay Dale; Manufacturer Part Number 1: IHLP3232DZER1R0M01; Part Description: FIXED IND 1UH 18A 5.78 MOHM SMD; Tolerance: ±20%; Frequency - Test: 100kHz; DC Resistance (DCR): 5.78 mOhm Max; Inductance: 1µH; Frequency - Self Resonant: 42MHz; Shielding: Shielded; Current - Saturation: 24A; Current Rating: 18A; Type: Molded; value: 1uH; Supplier 1: Digi-Key; Supplier Part Number 1: 541-1371-6-ND; Supplier Device Package: -; Packaging: Digi-Reel®; Height - Seated (Max): 0.158" (4.00mm); RoHS: RoHS Compliant; Size / Dimension: 0.340" L x 0.322" W (8.64mm x 8.18mm); Category: Inductors, Coils, Chokes; Mounting Type: Surface Mount; Material - Core: -; Package / Case: Nonstandard; Q @ Freq: -; Operating Temperature: -55°C ~ 125°C
LED1 LED2 LED7 LED8 = LED_green_red_SMD: Manufacturer Part Number 1: HSMF-C165; Manufacturer: Avago Technologies US Inc.; Part Description: LED GREEN/RED DIFFUSED 0603 SMD; Millicandela Rating: 15mcd Green, 10mcd Red; Lens Transparency: Diffused; Lens Color: White; Lens Style/Size: Rectangle with Flat Top, 1.60mm x 0.80mm; Wavelength - Peak: 570nm Green, 636nm Red; Wavelength - Dominant: 572nm Green, 621nm Red; Viewing Angle: 120°; Voltage - Forward (Vf) (Typ): 2.2V Green, 1.95V Red; Current - Test: 20mA; Color: Green, Red; Supplier 1: Digi-Key; Height (Max): 0.50mm; Packaging: Cut Tape (CT); Category: Optoelectronics; Mounting Type: Surface Mount; Package / Case: 0603 (1608 Metric); Size / Dimension: 1.60mm L x 0.80mm W; Supplier Device Package: *; RoHS: RoHS Compliant; Supplier Part Number 1: 516-1419-1-ND
LED3-LED6 = LED_green_red: Manufacturer Part Number 1: 4301F1/5; Manufacturer: Visual Communications Company - VCC; Part Description: LED GRN/RED DIFF 3MM ROUND T/H; Voltage - Forward (Vf) (Typ): 2.1V Green, 1.8V Red; Lens Color: White; Lens Style/Size: Round with Domed Top, 3mm (T-1), 2.90mm; Millicandela Rating: 12.6mcd Green, 3.7mcd Red; Color: Green, Red; Viewing Angle: 100°; Lens Transparency: Diffused; Current - Test: 20mA Green, 20mA Red; Wavelength - Peak: 565nm Green, 660nm Red; Supplier 1: Digi-Key; Supplier Part Number 1: 4301F1/5-ND; RoHS: RoHS Compliant; Packaging: Bulk; Package / Case: Radial; Mounting Type: Through Hole; Wavelength - Dominant: -; Supplier Device Package: T-1; Size / Dimension: -; Category: Optoelectronics; Height (Max): 5.44mm
LEDS1 LEDS2 = LEDx2_STANDOFF: Manufacturer Part Number 1: H-201C; Manufacturer: Bivar Inc.; Part Description: LED HOLDER RA 3MM 2LD NYL BK; LED: T1; Supplier 1: Digi-Key; Supplier Part Number 1: 492-1790-ND; Category: Optoelectronics; RoHS: RoHS Compliant; Color: Black; Length: 0.380" (9.65mm); Material: Nylon
MECH1-MECH4 = STANDOFF_M-F_THREADED_M3x8x10mm_HEX_5mm dia: STANDOFF M/F MET 5MM HEX 10MM L; Manufacturer: FIX&FASTEN; Manufacturer Part Number 1: FIX-MAE-5TV; Part Description: PCB distance; polyamide; L:5mm; Colour: natural; Øcutout:3mm; Unit: pcs; SuppliedAmount: 1000; MinAmount: 10; Type of spacer: PCB distance; Panel cutout diameter: 3mm; Spanner size: 5.5mm; Internal thread: M3; Thread pitch: 0,5; Supplier 1: TME; Supplier Part Number 1: FIX-MAE-5TV; Category: Plastic Pegs; Weight: 0.145; Multiples: 10; Material: polyamide; Spacer length: 5mm; Price Type: NET
R166 R167 R173 R176-R178 R188 R191 R192 R202 R204 R208 R212 = Res_0402: Manufacturer Part Number 1: RC0402JR-070RL; Manufacturer: Yageo; Part Description: RES SMD 0.0OHM JUMPER 1/16W 0402; Resistance (Ohms): 0.0; Tolerance: Jumper; Power (Watts): 0.063W, 1/16W; Value: 0R; Supplier 1: Digi-Key; Supplier Part Number 1: 311-0.0JRTR-ND; Category: Resistors; Temperature Coefficient: -; Features: Moisture Resistant; Supplier Device Package: 0402; Height: 0.016" (0.40mm); Package / Case: 0402 (1005 Metric); Operating Temperature: -55°C ~ 155°C; Size / Dimension: 0.039" L x 0.020" W (1.00mm x 0.50mm); Composition: Thick Film; Packaging: Tape & Reel (TR); Number of Terminations: 2; RoHS: RoHS Compliant
R168-R170 = Res_0402: Manufacturer Part Number 1: RMCF0402FT100R; Manufacturer: Stackpole Electronics Inc.; Part Description: RES SMD 100 OHM 1% 1/16W 0402; Power (Watts): 0.063W, 1/16W; Temperature Coefficient: ±100ppm/°C; Resistance (Ohms): 100; Value: 100R, 1%; Supplier 1: Digi-Key; Supplier Part Number 1: RMCF0402FT100RDKR-ND; Packaging: Digi-Reel®; Composition: Thick Film; Number of Terminations: 2; Package / Case: 0402 (1005 Metric); RoHS: RoHS Compliant; Category: Resistors; Size / Dimension: 0.039" L x 0.020" W (1.00mm x 0.50mm); Tolerance: ±1%; Supplier Device Package: 0402; Features: -; Height: 0.016" (0.40mm); Operating Temperature: -55°C ~ 155°C
R171 = Res_0402: Manufacturer Part Number 1: RMCF0402FT249R; Manufacturer: Stackpole Electronics Inc; Part Description: RES SMD 249 OHM 1% 1/16W 0402; Resistance (Ohms): 249; Power (Watts): 0.063W, 1/16W; Temperature Coefficient: ±100ppm/°C; Value: 249R, 1%; Supplier 1: Digi-Key; Supplier Part Number 1: RMCF0402FT249RCT-ND; Package / Case: 0402 (1005 Metric); Features: -; Size / Dimension: 0.039" L x 0.020" W (1.00mm x 0.50mm); Category: Resistors; Operating Temperature: -55°C ~ 155°C; Packaging: Cut Tape (CT); Tolerance: ±1%; Supplier Device Package: 0402; RoHS: RoHS Compliant; Composition: Thick Film; Number of Terminations: 2; Height: 0.016" (0.40mm)
R172 = Res_0402: Manufacturer Part Number 1: CRCW08050000Z0EA; Manufacturer: Vishay Dale; Part Description: RES SMD 0.0 OHM JUMPER 1/8W 0805; Power (Watts): 0.125W, 1/8W; Resistance (Ohms): 0.0; Tolerance: Jumper; Value: 0R; Supplier 1: Digi-Key; Supplier Part Number 1: 541-0.0ATR-ND; Package / Case: 0805 (2012 Metric); Height: 0.020" (0.50mm); Packaging: Tape & Reel (TR); Operating Temperature: -55°C ~ 155°C; Temperature Coefficient: -; RoHS: RoHS Compliant; Size / Dimension: 0.079" L x 0.049" W (2.00mm x 1.25mm); Supplier Device Package: 0805 (2012 Metric); Number of Terminations: 2; Category: Resistors; Features: Automotive AEC-Q200; Composition: Thick Film
R174 R179 R190 R193 R198 R203 = Res_0402: Manufacturer: Stackpole Electronics Inc; Manufacturer Part Number 1: RMCF0402FT1K00; Part Description: RES SMD 1K OHM 1% 1/16W 0402; Temperature Coefficient: ±100ppm/°C; Power (Watts): 0.063W, 1/16W; Value: 1k, 1%; Supplier 1: Digi-Key; Supplier Part Number 1: RMCF0402FT1K00TR-ND; Resistance (Ohms): 1k; Packaging: Tape & Reel (TR); Category: Resistors; RoHS: RoHS Compliant; Tolerance: ±1%; Height: 0.016" (0.40mm); Number of Terminations: 2; Package / Case: 0402 (1005 Metric); Operating Temperature: -55°C ~ 155°C; Features: -; Composition: Thick Film; Supplier Device Package: 0402; Size / Dimension: 0.039" L x 0.020" W (1.00mm x 0.50mm)
R175 = Res_0402: Manufacturer: Panasonic Electronic Components; Manufacturer Part Number 1: ERA-2AED471X; Power (Watts): 0.063W, 1/16W; Temperature Coefficient: ±25ppm/°C; Resistance (Ohms): 470; Value: 470R, 0.5%; Supplier 1: Digi-Key; Supplier Part Number 1: P470DETR-ND; Tolerance: ±0.5%; Packaging: Tape & Reel (TR); Number of Terminations: 2; Operating Temperature: -55°C ~ 155°C; RoHS: RoHS Compliant; Size / Dimension: 0.039" L x 0.020" W (1.00mm x 0.50mm); Composition: Thin Film; Package / Case: 0402 (1005 Metric); Height: 0.016" (0.40mm); Features: Automotive AEC-Q200; Supplier Device Package: 0402; Category: Resistors
R180 R186 R187 R195 R200 R205 R207 R211 = Res_0402: Manufacturer: Yageo; Manufacturer Part Number 1: RC0402FR-0710KL; Part Description: RES SMD 10K OHM 1% 1/16W 0402; Temperature Coefficient: ±100ppm/°C; Power (Watts): 0.063W, 1/16W; Value: 10k, 1%; Supplier 1: Digi-Key; Supplier Part Number 1: 311-10.0KLRTR-ND; Resistance (Ohms): 10k; Packaging: Tape & Reel (TR); RoHS: RoHS Compliant; Package / Case: 0402 (1005 Metric); Tolerance: ±1%; Operating Temperature: -55°C ~ 155°C; Size / Dimension: 0.039" L x 0.020" W (1.00mm x 0.50mm); Number of Terminations: 2; Category: Resistors; Height: 0.016" (0.40mm); Supplier Device Package: 0402; Features: Moisture Resistant; Composition: Thick Film
R181 R185 R196 = Res_0402: Manufacturer Part Number 1: ERJ-2RKF4422X; Manufacturer: Panasonic Electronic Components; Part Description: RES SMD 44.2K OHM 1% 1/10W 0402; Power (Watts): 0.1W, 1/10W; Temperature Coefficient: ±100ppm/°C; Value: 44.2k, 1%; Supplier 1: Digi-Key; Supplier Part Number 1: P44.2KLCT-ND; Tolerance: ±1%; Supplier Device Package: 0402; Packaging: Cut Tape (CT); Size / Dimension: 0.039" L x 0.020" W (1.00mm x 0.50mm); Features: Automotive AEC-Q200; Package / Case: 0402 (1005 Metric); Height: 0.016" (0.40mm); Operating Temperature: -55°C ~ 155°C; Number of Terminations: 2; Composition: Thick Film; Resistance (Ohms): 44.2k; RoHS: RoHS Compliant; Category: Resistors
R182 R197 R206 = Res_0402: Manufacturer Part Number 1: RMCF0402FT806R; Manufacturer: Stackpole Electronics Inc; Part Description: RES SMD 806 OHM 1% 1/16W 0402; Resistance (Ohms): 806; Power (Watts): 0.063W, 1/16W; Temperature Coefficient: ±100ppm/°C; Value: 806R, 1%; Supplier 1: Digi-Key; Supplier Part Number 1: RMCF0402FT806RCT-ND; Category: Resistors; Size / Dimension: 0.039" L x 0.020" W (1.00mm x 0.50mm); Tolerance: ±1%; Features: -; Number of Terminations: 2; RoHS: RoHS Compliant; Operating Temperature: -55°C ~ 155°C; Packaging: Cut Tape (CT); Package / Case: 0402 (1005 Metric); Composition: Thick Film; Height: 0.016" (0.40mm); Supplier Device Package: 0402
R183 = Res_0402: Manufacturer: Panasonic Electronic Components; Manufacturer Part Number: ERJ-2GEJ104X; Part Description: RES SMD 100K OHM 5% 1/10W 0402; Power (Watts): 0.1W, 1/10W; Temperature Coefficient: ±200ppm/°C; Value: 100k, 5%; Supplier 1: Digi-Key; Supplier Part Number 1: P100KJTR-ND; Category: Resistors; Size / Dimension: 0.039" L x 0.020" W (1.00mm x 0.50mm); Supplier Device Package: 0402; Composition: Thick Film; Number of Terminations: 2; RoHS: RoHS Compliant; Height: 0.016" (0.40mm); Operating Temperature: -55°C ~ 155°C; Features: Automotive AEC-Q200; Tolerance: ±5%; Packaging: Tape & Reel (TR); Resistance (Ohms): 100k; Package / Case: 0402 (1005 Metric)
R184 = Res_0402: Manufacturer: Stackpole Electronics Inc.; Manufacturer Part Number 1: RMCF0402FT2K21; Part Description: RES SMD 2.21K OHM 1% 1/16W 0402; Power (Watts): 0.063W, 1/16W; Temperature Coefficient: ±100ppm/°C; Value: 2.21k, 1%; Supplier 1: Digi-Key; Supplier Part Number 1: RMCF0402FT2K21CT-ND; Operating Temperature: -55°C ~ 155°C; Height: 0.016" (0.40mm); Tolerance: ±1%; Resistance (Ohms): 2.21k; Features: Automotive AEC-Q200; Package / Case: 0402 (1005 Metric); Packaging: Cut Tape (CT); Composition: Thick Film; Category: Resistors; Supplier Device Package: 0402; Number of Terminations: 2; RoHS: RoHS Compliant; Size / Dimension: 0.039" L x 0.020" W (1.00mm x 0.50mm)
R189 = Res_0402: Manufacturer Part Number: RC0402FR-07750RL; Manufacturer: Yageo; Part Description: RES SMD 750 OHM 1% 1/16W 0402; Resistance (Ohms): 750; Power (Watts): 0.063W, 1/16W; Temperature Coefficient: ±100ppm/°C; Value: 750R, 1%; Tolerance: ±1%; Number of Terminations: 2; Supplier Device Package: 0402; Size / Dimension: 0.039" L x 0.020" W (1.00mm x 0.50mm); Height: 0.016" (0.40mm); Composition: Thick Film; Features: Moisture Resistant; Operating Temperature: -55°C ~ 155°C; Package / Case: 0402 (1005 Metric); Supplier 1: Digi-Key; RoHS: RoHS Compliant; Category: Resistors; Packaging: Cut Tape (CT); Supplier Part Number 1: 311-750LRCT-ND
R194 = Res_0402: Manufacturer Part Number: CRCW0402560RFKED; Manufacturer: Vishay Dale; Part Description: RES SMD 560 OHM 1% 1/16W 0402; Resistance (Ohms): 560; Power (Watts): 0.063W, 1/16W; Temperature Coefficient: ±100ppm/°C; RoHS: RoHS Compliant; Packaging: Cut Tape (CT); Composition: Thick Film; Tolerance: ±1%; Number of Terminations: 2; Supplier Device Package: 0402 (1005 Metric); Operating Temperature: -55°C ~ 155°C; Features: Automotive AEC-Q200; Category: Resistors; Supplier Part Number 1: 541-560LCT-ND; Package / Case: 0402 (1005 Metric); Supplier 1: Digi-Key; Height: 0.016" (0.40mm); Size / Dimension: 0.039" L x 0.020" W (1.00mm x 0.50mm)
R199 = Res_0402: Manufacturer: Panasonic Electronic Components; Manufacturer Part Number 1: ERJ-2RKF1243X; Part Description: RES SMD 124K OHM 1% 1/10W 0402; Power (Watts): 0.1W, 1/10W; Temperature Coefficient: ±100ppm/°C; Value: 124k, 1%; Supplier 1: Digi-Key; Supplier Part Number 1: P124KLCT-ND; Category: Resistors; Package / Case: 0402 (1005 Metric); Operating Temperature: -55°C ~ 155°C; Tolerance: ±1%; Packaging: Cut Tape (CT); Resistance (Ohms): 124k; Features: Automotive AEC-Q200; Height: 0.016" (0.40mm); Number of Terminations: 2; Supplier Device Package: 0402; Size / Dimension: 0.039" L x 0.020" W (1.00mm x 0.50mm); RoHS: RoHS Compliant; Composition: Thick Film
R201 = Res_0402: Manufacturer Part Number 1: ERJ-2RKF6652X; Manufacturer: Panasonic Electronic Components; Part Description: RES SMD 66.5K OHM 1% 1/10W 0402; Temperature Coefficient: ±100ppm/°C; Power (Watts): 0.1W, 1/10W; Value: 66.5k, 1%; Supplier 1: Digi-Key; Supplier Part Number 1: P66.5KLDKR-ND; Packaging: Digi-Reel®; Operating Temperature: -55°C ~ 155°C; Height: 0.016" (0.40mm); Size / Dimension: 0.039" L x 0.020" W (1.00mm x 0.50mm); Number of Terminations: 2; Package / Case: 0402 (1005 Metric); Resistance (Ohms): 66.5k; Category: Resistors; Supplier Device Package: 0402; Features: Automotive AEC-Q200; Composition: Thick Film; RoHS: RoHS Compliant; Tolerance: ±1%
R209 = Res_0402: Part Description: RES SMD 39K OHM 1% 1/16W 0402; Manufacturer Part Number 1: RC0402FR-0739KL; Manufacturer: Yageo; Power (Watts): 0.063W, 1/16W; Temperature Coefficient: ±100ppm/°C; Value: 39k, 1%; Supplier 1: Digi-Key; Supplier Part Number 1: 311-39.0KLRCT-ND; Operating Temperature: -55°C ~ 155°C; Height: 0.016" (0.40mm); Supplier Device Package: 0402; Composition: Thick Film; RoHS: RoHS Compliant; Number of Terminations: 2; Part Status: Active; Category: Resistors; Tolerance: ±1%; Resistance (Ohms): 39k; Package / Case: 0402 (1005 Metric); Features: Moisture Resistant; Size / Dimension: 0.039" L x 0.020" W (1.00mm x 0.50mm); Packaging: Cut Tape (CT)
R210 = Res_0402: Part Description: RES SMD 23.2K OHM 1% 1/16W 0402; Manufacturer: Yageo; Manufacturer Part Number 1: RC0402FR-0723K2L; Power (Watts): 0.063W, 1/16W; Temperature Coefficient: ±100ppm/°C; Value: 23.2k, 1%; Supplier 1: Digi-Key; Supplier Part Number 1: YAG3066CT-ND; Part Status: Active; Operating Temperature: -55°C ~ 155°C; Package / Case: 0402 (1005 Metric); Packaging: Cut Tape (CT); Number of Terminations: 2; Height: 0.016" (0.40mm); Tolerance: ±1%; Composition: Thick Film; Supplier Device Package: 0402; Size / Dimension: 0.039" L x 0.020" W (1.00mm x 0.50mm); Resistance (Ohms): 23.2k; Category: Resistors; Features: Moisture Resistant; RoHS: RoHS Compliant
VD1 = DIODE_SCHOTTKY_SOD-523F: Diode Schottky SMD SOD-523F; Manufacturer Part Number 1: SK36A-LTP; Manufacturer: Micro Commercial Co; Part Description: DIODE SCHOTTKY 60V 3A DO214AC; Current - Reverse Leakage @ Vr: 500µA @ 60V; Speed: Fast Recovery =< 500ns, > 200mA (Io); Voltage - DC Reverse (Vr) (Max): 60V; Capacitance @ Vr, F: 250pF @ 4V, 1MHz; Voltage - Forward (Vf) (Max) @ If: 750mV @ 3A; Current - Average Rectified (Io): 3A; Supplier 1: Digi-Key; Supplier Part Number 1: SK36A-LTPMSCT-ND; Package / Case: DO-214AC, SMA; Reverse Recovery Time (trr): -; Diode Type: Schottky; Category: Discrete Semiconductor Products; Mounting Type: Surface Mount; RoHS: RoHS Compliant; Packaging: Cut Tape (CT); Operating Temperature - Junction: -50°C ~ 125°C; Supplier Device Package: DO-214AC (SMA)